# EAGLE schematic design_bci (EAGLE 9.6.2)
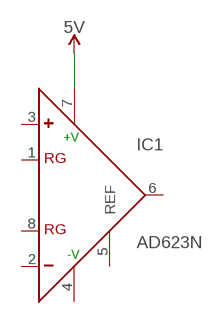
[diagram p0: schematic, sheet 1]

## Parts
IC1  AD623N  [DIL08]

## Nets
5V: IC1.7(+V)
Unconnected: IC1.1(RG) IC1.2(-) IC1.3(+) IC1.5(REF) IC1.6(OUT) IC1.8(RG)

## Power pins joined to a net without a drawn wire
-V: IC1.4(-V)

## Library data of the parts
IC1 = LinnesLab-AnalogIC:AD623: Single-Supply, Rail-to-Rail, Low Cost Instrumentation Amplifier Source: http://www.analog.com/static/imported-files/data_sheets/AD623.pdf; MF: ALTERA CORPORATION; MPN: AD623ANZ; OC_FARNELL: 9603700; OC_NEWARK: 59K4402